# EAGLE schematic module (EAGLE 9.5.2)

## Sheet 1 of 2
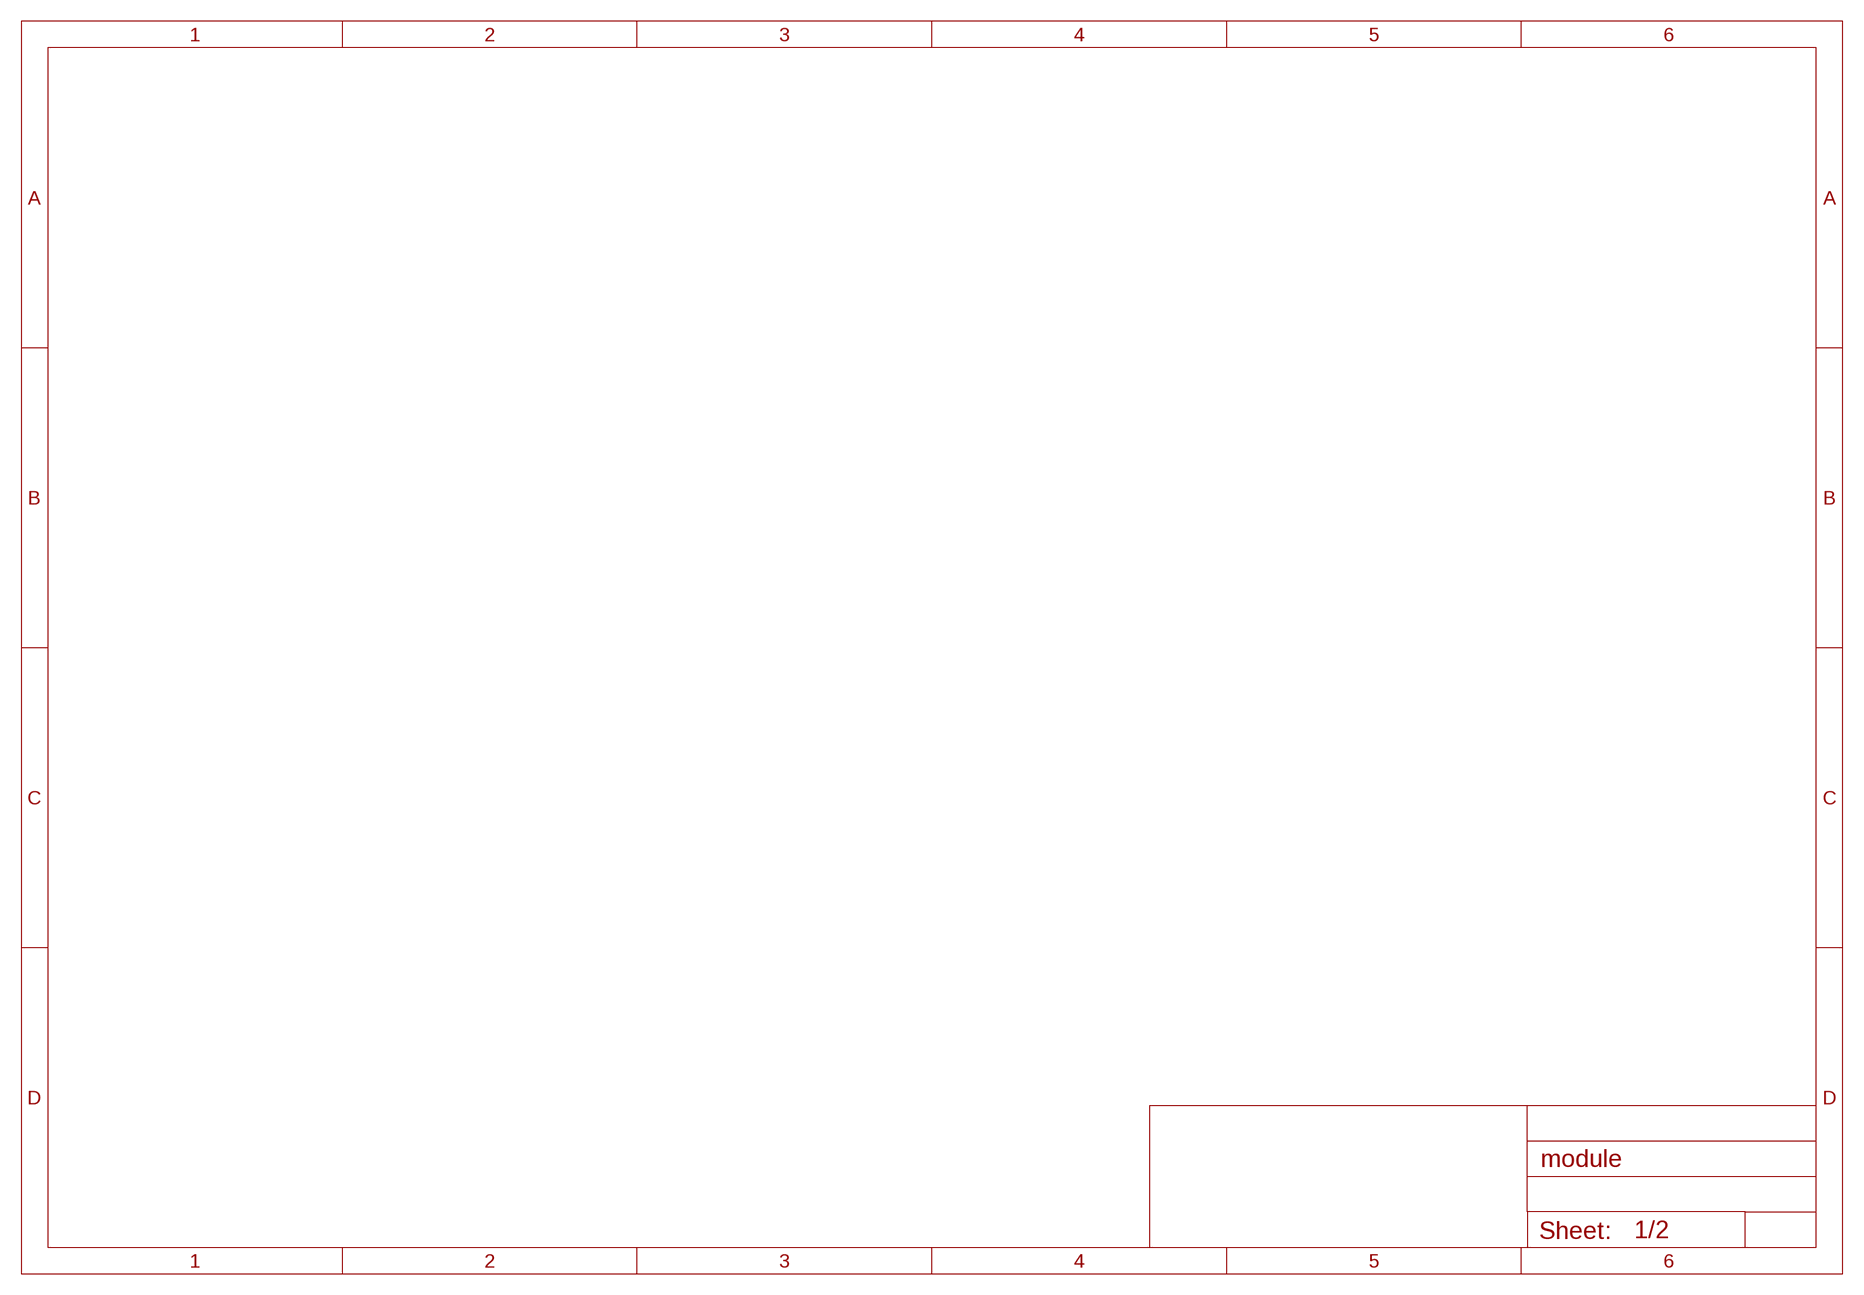
[diagram p0: schematic, sheet 1]

## Sheet 2 of 2
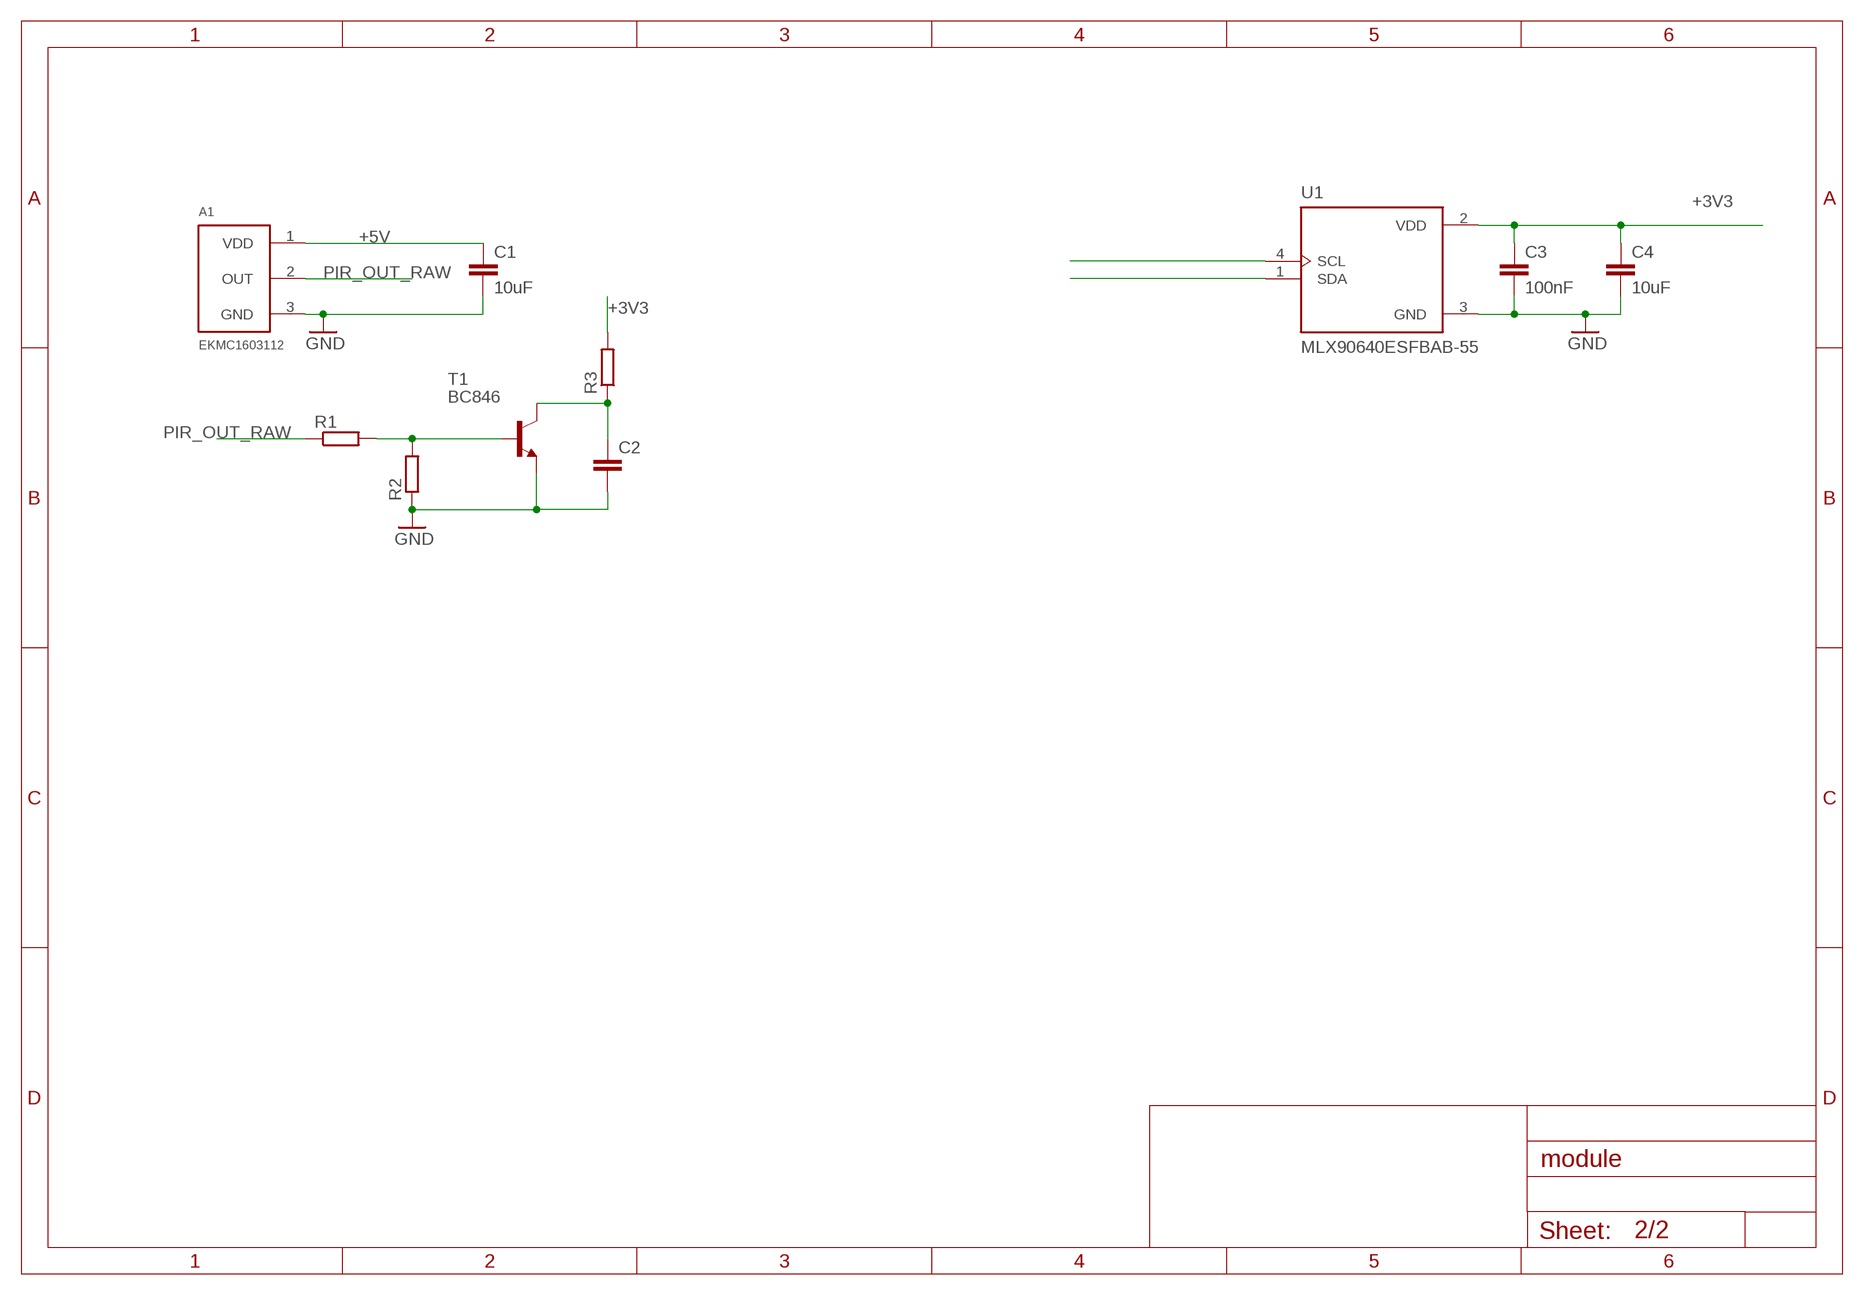
[diagram p1: schematic, sheet 2]

### Parts
A1  EKMC1603112  [TO254P2200H2020-3]
C1  10uF  C-EUC0805  [C0805]
C2  C-EUC0603  [C0603]
C3  100nF  C-EUC0603  [C0603]
C4  10uF  C-EUC0805  [C0805]
R1  R-EU_R0603  [R0603]
R2  R-EU_R0603  [R0603]
R3  R-EU_R0603  [R0603]
T1  BC846  [SOT23]
U1  MLX90640ESFBAB-55  [TO292-55]

### Nets
+3V3: C3.1 C4.1 R3.2 U1.2(VDD)
+5V: A1.1(VDD) C1.1
GND: A1.3(GND) C1.2 C2.2 C3.2 C4.2 R2.1 T1.2(E) U1.3(GND)
N$1: U1.4(SCL)
N$2: U1.1(SDA)
N$3: R1.2 R2.2 T1.1(B)
N$4: C2.1 R3.1 T1.3(C)
PIR_OUT_RAW: A1.2(OUT) R1.1

## Library data of the parts
A1 = parts-panasonic:EKMC1603112: EKMC Series 0.5 V Digital Passive Infrared Polyethylene Black Lens Motion Sensor; AVAILABILITY: Unavailable; DESCRIPTION: Sensor PIR _Passive Infrared_ 472 _12m_ 39.4' Polyethylene, Black Lens; MF: Panasonic Electric; MP: EKMC1603112; PACKAGE: - Panasonic Electric; PRICE: None
C1-C4 = rcl:C-EU: CAPACITOR, European symbol; SPICEPREFIX: C
R1-R3 = rcl:R-EU_: RESISTOR, European symbol; SPICEPREFIX: R
T1 = transistor:BC846: NPN TRANSISTOR
U1 = parts-melexis:MLX90640: SENSOR DGTL -40C-85C TO39